# Altium project TDA7292 Amplifier.PrjPcb
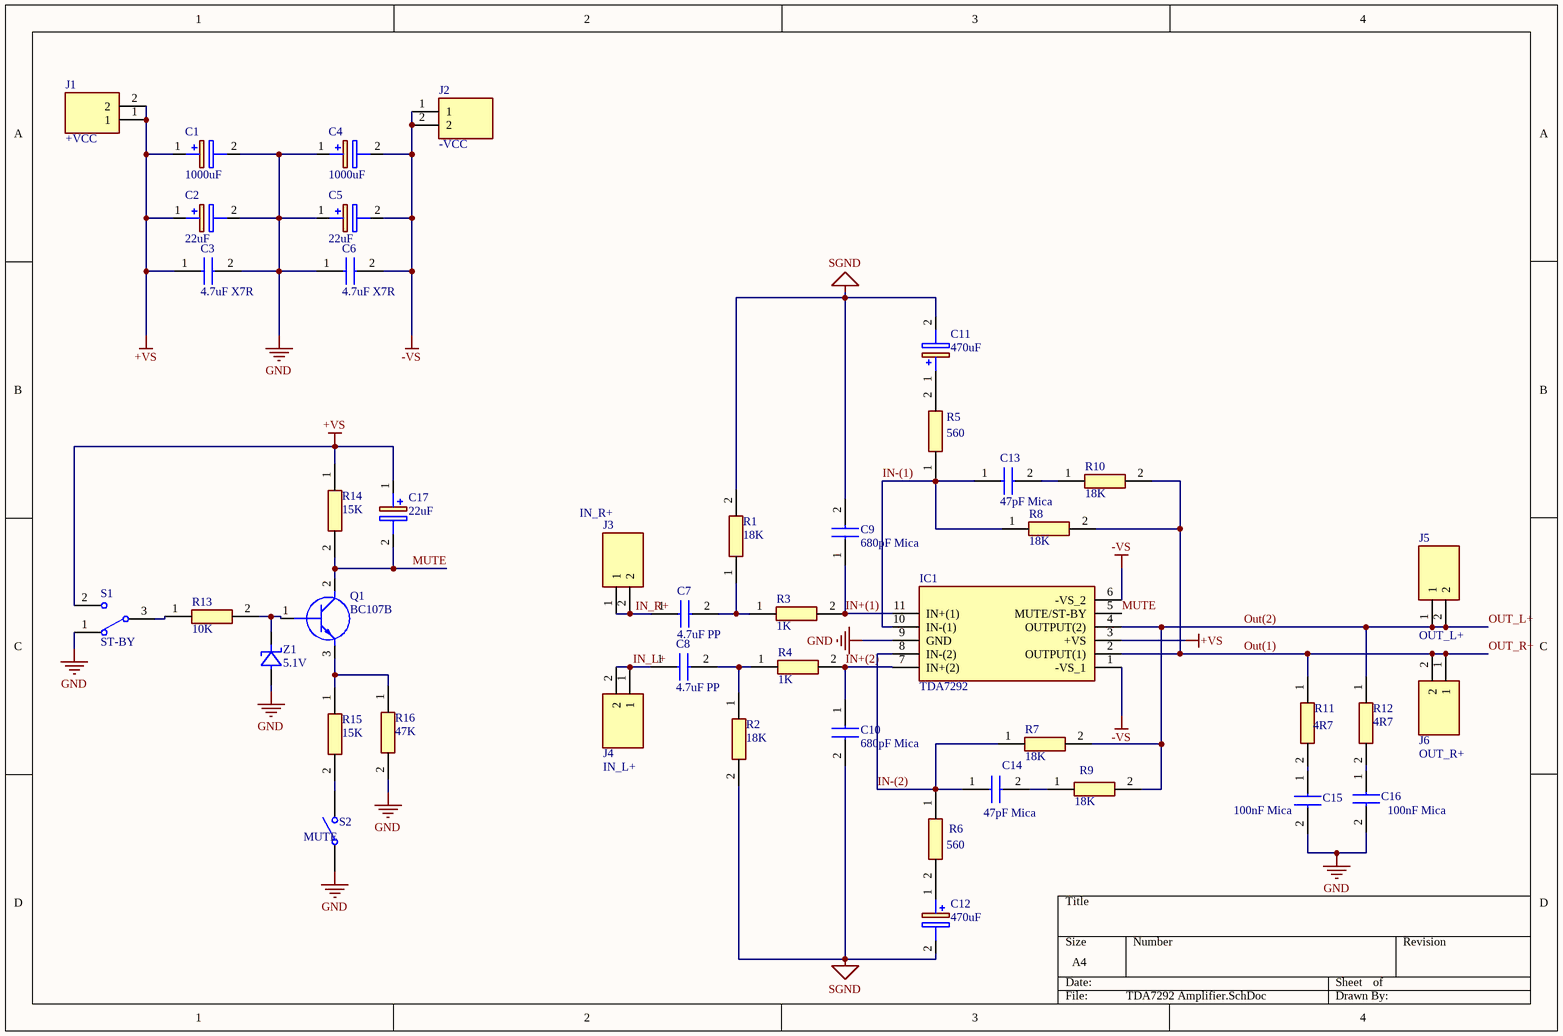
[diagram p0: TDA7292 Amplifier.SchDoc]
1 sheet, 44 parts. Net scope: global (net labels, ports and power ports of the same name join across sheets).
Board file: TDA7292 Amplifier.PcbDoc

## Sheet TDA7292 Amplifier.SchDoc: TDA7292 Amplifier
size A4; Author: Karuppusamy; DrawnBy: Karuppusamy; Engineer: Karuppusamy; Address1: 12, Main Road; Address2: Pongaliyur; Address3: Kottur, Pollachi; Address4: Tamil Nadu, India - 642114

### Parts
C1  1000uF  [Capacitor 1000uF]
C2  22uF  [Capacitor 22uF]
C3  4.7uF X7R  [Capacitor 4.7UF 50V X7R]
C4  1000uF  [Capacitor 1000uF]
C5  22uF  [Capacitor 22uF]
C6  4.7uF X7R  [Capacitor 4.7UF 50V X7R]
C7  4.7uF PP  [4.7UF Polypropylene]
C8  4.7uF PP  [4.7UF Polypropylene]
C9  680pF Mica  [680pF Mica]
C10  680pF Mica  [680pF Mica]
C11  470uF  [Capacitor 470uF]
C12  470uF  [Capacitor 470uF]
C13  47pF Mica  [47pF Mica]
C14  47pF Mica  [47pF Mica]
C15  100nF Mica  [680pF Mica]
C16  100nF Mica  [680pF Mica]
C17  22uF  [Capacitor 22uF]
IC1  TDA7292  [TDA7292]
J1  +VCC  [Spade Terminals]
J2  -VCC  [Spade Terminals]
J3  IN_R+  [Spade Terminals]
J4  IN_L+  [Spade Terminals]
J5  OUT_L+  [Spade Terminals]
J6  OUT_R+  [Spade Terminals]
Q1  BC107B  [TO-18]
R1  18K  [RES 1/4W]
R2  18K  [RES 1/4W]
R3  1K  [RES 1/4W]
R4  1K  [RES 1/4W]
R5  560  [RES 1/4W]
R6  560  [RES 1/4W]
R7  18K  [RES 1/4W]
R8  18K  [RES 1/4W]
R9  18K  [RES 1/4W]
R10  18K  [RES 1/4W]
R11  4R7  [RES 1W]
R12  4R7  [RES 1W]
R13  10K  [RES 1/4W]
R14  15K  [RES 1/4W]
R15  15K  [RES 1/4W]
R16  47K  [RES 1/4W]
S1  ST-BY  [SPDT]
S2  MUTE  [SPST]
Z1  5.1V  [DO-35 Zener]

### Nets
+VS: C1.1(+) C2.1(+) C3.1 C17.1(+) IC1.3(+VS) J1.1 J1.2 R14.1 S1.2
-VS: C4.2(-) C5.2(-) C6.2 IC1.1(-VS_1) IC1.6(-VS_2) J2.1 J2.2
GND: C1.2(-) C2.2(-) C3.2 C4.1(+) C5.1(+) C6.1 C15.2 C16.2 IC1.9(GND) R16.2 S1.1 S2.1(COMMON) Z1.2
SGND: C9.2 C10.2 C11.2(-) C12.2(-) R1.2 R2.2
IN+(1): C9.1 IC1.11(IN+(1)) R3.2
IN+(2): C10.1 IC1.7(IN+(2)) R4.2
IN-(1): C13.1 IC1.10(IN-(1)) R5.1 R8.1
IN-(2): C14.1 IC1.8(IN-(2)) R6.1 R7.1
IN_L+: C8.1 J4.1 J4.2
IN_R+: C7.1 J3.1 J3.2
MUTE: C17.2(-) IC1.5(MUTE/ST-BY) Q1.2(C) R14.2
Out(1): IC1.2(OUTPUT(1)) J6.1 J6.2 R8.2 R10.2 R11.1  [also labelled OUT_R+]
Out(2): IC1.4(OUTPUT(2)) J5.1 J5.2 R7.2 R9.2 R12.1  [also labelled OUT_L+]
NetC7_2: C7.2 R1.1 R3.1
NetC8_2: C8.2 R2.1 R4.1
NetC11_1: C11.1(+) R5.2
NetC12_1: C12.1(+) R6.2
NetC13_2: C13.2 R10.1
NetC14_2: C14.2 R9.1
NetC15_1: C15.1 R11.2
NetC16_1: C16.1 R12.2
NetQ1_1: Q1.1(B) R13.2 Z1.1
NetQ1_3: Q1.3(E) R15.1 R16.1
NetR13_1: R13.1 S1.3
NetR15_2: R15.2 S2.2(NO)

### Library data of the parts
C1 C4 = 1000uF: Electroletic Capacitor Polarised; Manufacturer_Name: Nichicon; Manufacturer_Part_Number: UHE1H102MHD6TN; Datasheet Link: http://nichicon-us.com/english/products/pdfs/e-uhe.pdf; Height: 27mm; Mouser Part Number: 647-UHE1H102MHD6TN; Mouser Price/Stock: https://www.mouser.com/Search/Refine.aspx?Keyword=647-UHE1H102MHD6TN
C2 C5 C17 = 22uF: Electroletic Capacitor Polarised; Manufacturer_Name: Panasonic; Manufacturer_Part_Number: EEU-FM1H220; Datasheet Link: https://industrial.panasonic.com/cdbs/www-data/pdf/RDF0000/ABA0000C1018.pdf; Height: 12.5mm; Mouser Part Number: 667-EEU-FM1H220; Mouser Price/Stock: https://www.mouser.com/Search/Refine.aspx?Keyword=667-EEU-FM1H220
C3 C6 = 4.7uF X7R: Capacitor 4.7UF 50V X7R; Manufacturer_Name: Murata Electronics; Manufacturer_Part_Number: RCER71H475K3M1H03A; Datasheet Link: https://psearch.en.murata.com/capacitor/product/RCER71H475K3M1H03A.html; Height: 7.5mm; Mouser Part Number: 81-RCER71H475K3M1H3A; Mouser Price/Stock: https://www.mouser.com/Search/Refine.aspx?Keyword=81-RCER71H475K3M1H3A
C7 C8 = 4.7uF PP: Cap Film 4.7uF 450VDC PP 5% (25.3 X 11.7 X 16.4mm) Radial 22.5mm 110C Bulk; Manufacturer: Panasonic; Manufacturer Part Number: ECW-FD2W475J; Voltage Rating (DC): 450V; Lead/Base Style: Straight; Lead Diameter: 0.8mm; Supplier 1: Digi-Key; RoHS: Yes; Category: Film Capacitors; Stock 1: 1224; Pricing 1: 1=1.26000, 10=0.99800, 100=0.74880, 500=0.56576, 1000=0.49920, 2500=0.46592, 5000=0.44928 (USD); Mount: Through Hole; Case/Package: Radial; Number of Pins: 2; Dielectric Material: PP; Contact Plating: Tin; Min Operating Temperature: -40°C; Max Operating Temperature: 110°C; Termination: Radial; Dielectric: PP; Package Quantity: 100; Packaging: Bulk; Tolerance: 5%; Voltage: 450V; Voltage Rating: 450V; Length: 25.3mm; Height: 16.4mm; Height - Seated (Max): 0.646inch; Width: 11.7mm; Lead Pitch: 22.5mm; Depth: 11.7mm; REACH SVHC: Unknown; ComponentLink1URL: https://datasheet.ciiva.com/30042/abd0000ce52-30042702.pdf?src-supplier=Avnet; ComponentLink1Description: https://datasheet.ciiva.com/30042/abd0000ce52-30042702.pdf?src-supplier=Avnet; Supplier Part Number 1: P16728-ND; Capacitance: 4.7uF
C9 C10 C15 C16 = 680pF Mica: Capacitor 680pF Mica; Manufacturer_Name: Cornell Dubilier; Manufacturer_Part_Number: CD15FD221FO3F; Allied_Number: 70190178; Datasheet Link: https://componentsearchengine.com/Datasheets/2/CD15FD221FO3F.pdf; Height: 11.681mm; Mouser Part Number: 598-CD15FD221FO3F; Mouser Price/Stock: https://www.mouser.com/Search/Refine.aspx?Keyword=598-CD15FD221FO3F; RS Part Number: 8713331; RS Price/Stock: http://uk.rs-online.com/web/p/products/8713331; Allied Price/Stock: https://www.alliedelec.com/cornell-dubilier-cd15fd221fo3f/70190178/
C11 C12 = 470uF: Electroletic Capacitor Polarised; Manufacturer_Name: Panasonic; Manufacturer_Part_Number: EEUFM1H471; Datasheet Link: https://industrial.panasonic.com/cdbs/www-data/pdf/RDF0000/ABA0000C1018.pdf; Height: 22mm; RS Part Number: 5261698P; RS Price/Stock: http://uk.rs-online.com/web/p/products/5261698P
C13 C14 = 47pF Mica: Capacitor 47pF Mica; Manufacturer_Name: Cornell Dubilier; Manufacturer_Part_Number: CD15FD221FO3F; Allied_Number: 70190178; Datasheet Link: https://componentsearchengine.com/Datasheets/2/CD15FD221FO3F.pdf; Height: 11.681mm; Mouser Part Number: 598-CD15FD221FO3F; Mouser Price/Stock: https://www.mouser.com/Search/Refine.aspx?Keyword=598-CD15FD221FO3F; RS Part Number: 8713331; RS Price/Stock: http://uk.rs-online.com/web/p/products/8713331; Allied Price/Stock: https://www.alliedelec.com/cornell-dubilier-cd15fd221fo3f/70190178/
IC1 = TDA7292: Integrated Circuit; Manufacturer_Name: STMicroelectronics; Datasheet Link: http://www.st.com/content/ccc/resource/technical/document/datasheet/1a/b1/d0/90/8b/8d/40/fe/CD00236549.pdf/files/CD00236549.pdf/jcr:content/translations/en.CD00236549.pdf; Height: 5mm; Manufacturer_Part_Number: TDA7292; Mouser Part Number: 511-TDA7292; Mouser Price/Stock: https://www.mouser.com/Search/Refine.aspx?Keyword=511-TDA7292
J1-J6 = Spade Terminals: Connector; Manufacturer_Name: TE Connectivity; Manufacturer_Part_Number: 725964-2; Allied_Number: 70285916; Datasheet Link: https://www.te.com/commerce/DocumentDelivery/DDEController?Action=showdoc&DocId=Customer+Drawing%7F725964%7FD2%7Fpdf%7FEnglish%7FENG_CD_725964_D2.pdf%7F725964-2; Height: 13.1mm; Mouser Part Number: 571-725964-2; Mouser Price/Stock: https://www.mouser.com/Search/Refine.aspx?Keyword=571-725964-2; RS Part Number: 1640091; RS Price/Stock: http://uk.rs-online.com/web/p/products/1640091; Allied Price/Stock: https://www.alliedelec.com/teconnectivity-725964-2/70285916/
Q1 = BC107B: Transistor BJT NPN; Manufacturer_Name: STMicroelectronics; Datasheet Link: http://docs-emea.rs-online.com/webdocs/0e77/0900766b80e779e3.pdf; Manufacturer_Part_Number: BC107B; Mouser Part Number: 511-BC107B; Mouser Price/Stock: https://www.mouser.com/Search/Refine.aspx?Keyword=511-BC107B; RS Part Number: 7140489P; RS Price/Stock: http://uk.rs-online.com/web/p/products/7140489P
R1-R10 R13-R16 = Resistor 1/4W: Resistor; Manufacturer_Name: YAGEO (PHYCOMP); Manufacturer_Part_Number: CFR-25JT-52-1K; Datasheet Link: http://www.yageo.com/NewPortal/yageodocoutput?fileName=/pdf/throughhole/Yageo_LR_CFR_2013.pdf; Mouser Part Number: 603-CFR-25JT-52-1K; Mouser Price/Stock: https://www.mouser.com/Search/Refine.aspx?Keyword=603-CFR-25JT-52-1K
R11 R12 = Resistor 1W: Manufacturer_Name: Ohmite; Manufacturer_Part_Number: OM2405E-R58; Datasheet Link: https://www.mouser.com/datasheet/2/942/SF_AGH_Series-1508337.pdf; Mouser Part Number: 588-OM2405E-R58; Mouser Price/Stock: https://www.mouser.com/Search/Refine.aspx?Keyword=588-OM2405E-R58
S1 = SW-SPDT: SPDT Subminiature Toggle Switch, Right Angle Mounting, Vertical Actuation; Published: 24-Mar-1999; LatestRevisionDate: 17-Dec-2003; LatestRevisionNote: Schematic revised, PCB Footprint replaced.; DatasheetVersion: 05-Dec-2000; PackageReference: TL36WW15050; Publisher: Altium Limited; PackageDescription: Switch; 4 Leads; ComponentLink1Description: Manufacturer Link; ComponentLink1URL: http://www.apem.com
S2 = SW-SPST: Single-Pole, Single-Throw Switch; Published: 24-Mar-1999; LatestRevisionDate: 17-Jul-2002; LatestRevisionNote: Re-released for DXP Platform.; PackageReference: SPST-2; Publisher: Altium Limited; PackageDescription: Switch; 2 Leads
Z1 = Zener: Zener Diode 5.1V; Manufacturer_Part_Number: BZX55C5V1-TAP; Vendor: Vishay; Built_By: EMA_UL_Team; Copyright: Copyright (C) 2018 Accelerated Designs. All rights reserved; RefDes: RefDes; Type: DEV; Value: Value